# EAGLE design mcu_board_b (EAGLE 7.5.0)
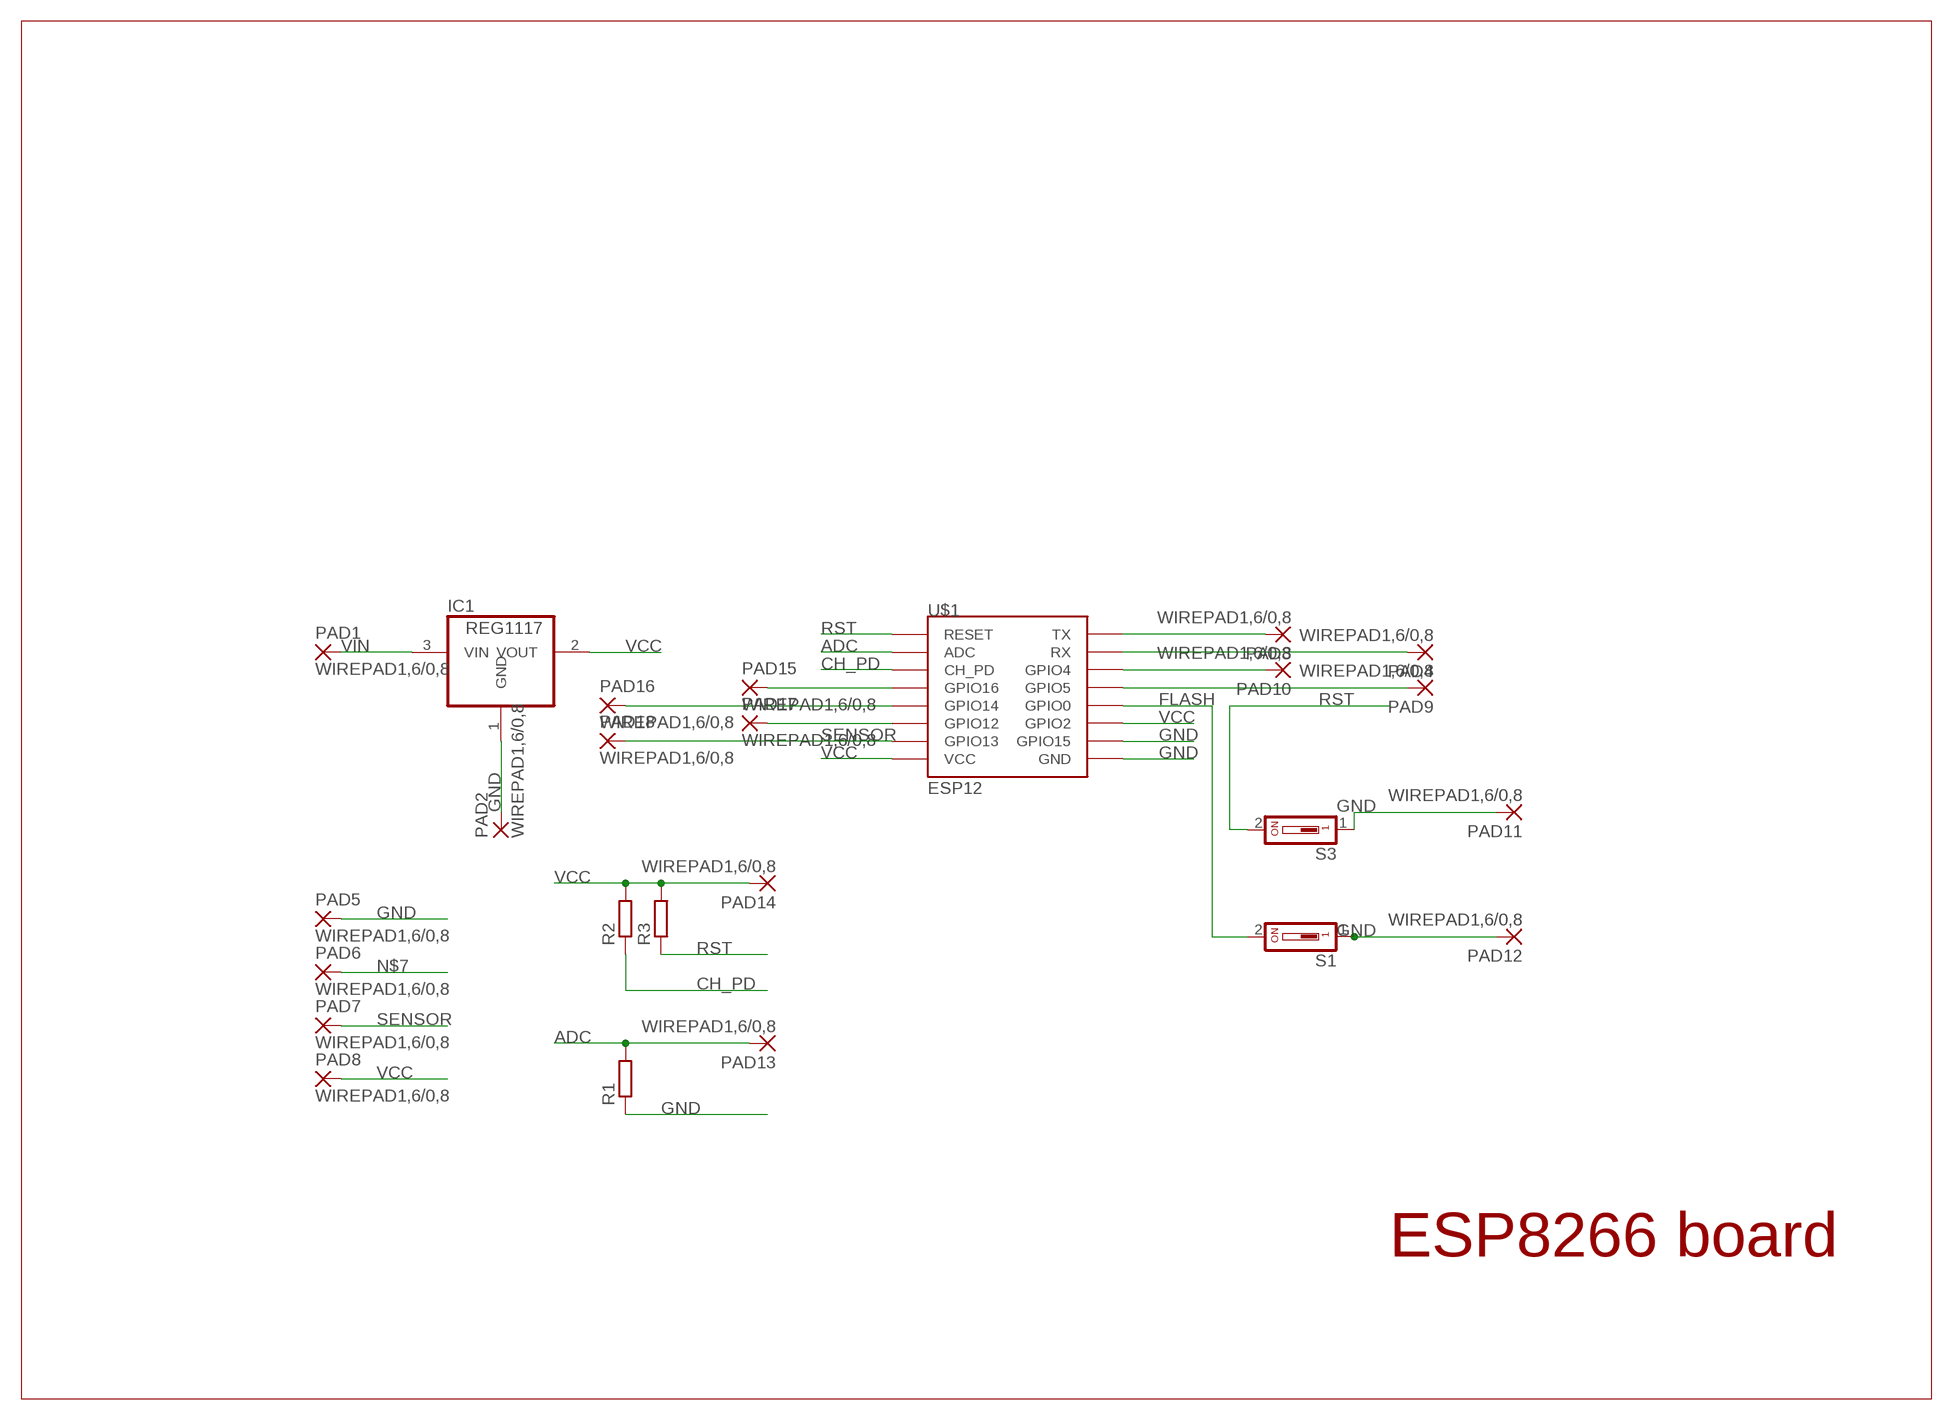
[diagram p0: schematic, sheet 1]

## Parts
IC1  REG1117  [SOT223]
PAD1  WIREPAD1,6/0,8  [1,6/0,8]
PAD2  WIREPAD1,6/0,8  [1,6/0,8]
PAD3  WIREPAD1,6/0,8  [1,6/0,8]
PAD4  WIREPAD1,6/0,8  [1,6/0,8]
PAD5  WIREPAD1,6/0,8  [1,6/0,8]
PAD6  WIREPAD1,6/0,8  [1,6/0,8]
PAD7  WIREPAD1,6/0,8  [1,6/0,8]
PAD8  WIREPAD1,6/0,8  [1,6/0,8]
PAD9  WIREPAD1,6/0,8  [1,6/0,8]
PAD10  WIREPAD1,6/0,8  [1,6/0,8]
PAD11  WIREPAD1,6/0,8  [1,6/0,8]
PAD12  WIREPAD1,6/0,8  [1,6/0,8]
PAD13  WIREPAD1,6/0,8  [1,6/0,8]
PAD14  WIREPAD1,6/0,8  [1,6/0,8]
PAD15  WIREPAD1,6/0,8  [1,6/0,8]
PAD16  WIREPAD1,6/0,8  [1,6/0,8]
PAD17  WIREPAD1,6/0,8  [1,6/0,8]
PAD18  WIREPAD1,6/0,8  [1,6/0,8]
R1  R-EU_M0805  [M0805]
R2  R-EU_M0805  [M0805]
R3  R-EU_M0805  [M0805]
S1  DS01  [DS-01]
S3  DS01  [DS-01]
U$1  ESP12  [ESP12]

## Nets
ADC: PAD13.1(P) R1.2 U$1.ADC
CH_PD: R2.1 U$1.CH_PD
FLASH: S1.2 U$1.GPIO0
GND: IC1.1(GND) PAD2.1(P) PAD5.1(P) PAD11.1(P) PAD12.1(P) R1.1 S1.1 S3.1 U$1.GND U$1.GPIO15
N$1: PAD3.1(P) U$1.TX
N$2: PAD4.1(P) U$1.RX
N$3: PAD10.1(P) U$1.GPIO4
N$4: PAD9.1(P) U$1.GPIO5
N$5: PAD15.1(P) U$1.GPIO16
N$6: PAD16.1(P) U$1.GPIO14
N$7: PAD6.1(P)
N$8: PAD17.1(P) U$1.GPIO12
RST: R3.1 S3.2 U$1.RESET
SENSOR: PAD7.1(P) PAD18.1(P) U$1.GPIO13
VCC: IC1.2(VOUT) PAD8.1(P) PAD14.1(P) R2.2 R3.2 U$1.GPIO2 U$1.VCC
VIN: IC1.3(VIN) PAD1.1(P)

## Notes on the sheet
- ESP8266 board

## Library data of the parts
IC1 = burr-brown:REG1117: 800mA and 1A Low Dropout (LDO) Positive Regulator 1.8V, 2.5V, 2.85V, 3.3V, 5V, and Adj; MPN: REG1117; OC_FARNELL: 1097566; OC_NEWARK: 14P6981
PAD1-PAD18 = wirepad:WIREPAD: Wire PAD connect wire on PCB
R1-R3 = rcl:R-EU_: RESISTOR, European symbol
S1 S3 = switch-dil:DS01: DIL/CODE SWITCH; OC_FARNELL: unknown; OC_NEWARK: unknown
U$1 = esp8266modules:ESP12: ESP8266 Wifi module 12

## Board
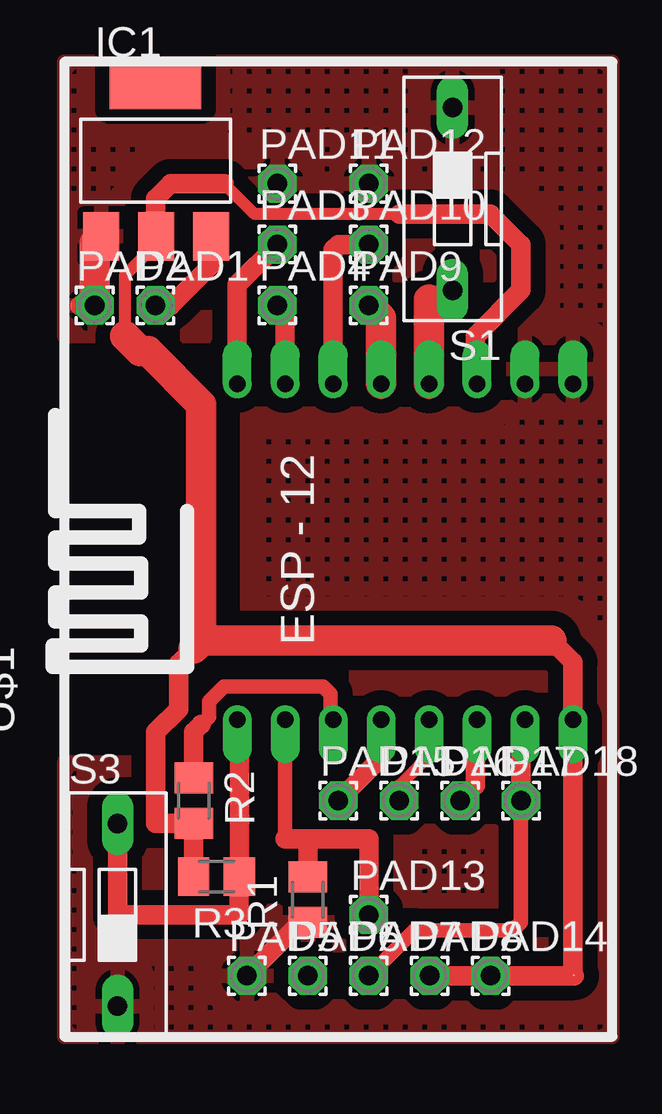
[diagram p1: board, top side]
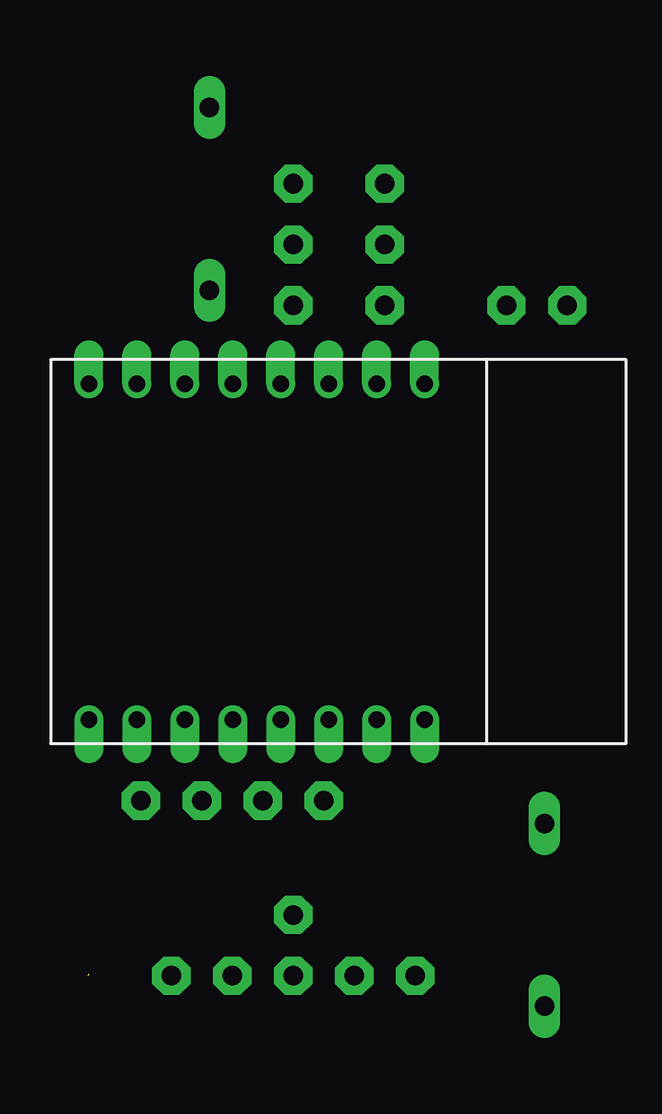
[diagram p2: board, bottom side, seen from below]

No outline drawn. Coordinates in mm, seen from the top.
Copper layers (1*16): Top 0.035mm / dielectric 1.5mm / Bottom 0.035mm
Design rules "default": minimum track width 10mil, minimum drill 24mil, track to track 8mil, track to pad 8mil, pad to pad 8mil, via to via 8mil, smd to smd 8mil, copper to edge 40mil, drill to drill 8mil, minimum pad ring 10mil, minimum via ring 8mil, stop-mask expansion 4mil, vias tented up to drill 0mil, thermal gap 10mil

### Footprints (pad centres in the part's own frame; a part is rotated, then mirrored left to right if it is on the bottom)
SOT223 = smd 1.499 x 2.007: 1 -2.261,-3.15; 2 0.025,-3.15; 3 2.311,-3.15 | smd 3.81 x 2.007: 4 0,3.15
1,6/0,8 = drill 0.813 pad 1.6 octagon: 1 0,0
M0805 = smd 1.3 x 1.6: 1 -0.95,0; 2 0.95,0
DS-01 = drill 0.813 long: 1 0,-3.81; 2 0,3.81
ESP12 = drill 0.7 offset: ADC -7.1,3.8; CH_PD -7.1,1.8; GND 6.9,-8.2; GPIO0 6.9,-2.2; GPIO2 6.9,-4.2; GPIO4 6.9,1.8; GPIO5 6.9,-0.2; GPIO12 -7.1,-4.2; GPIO13 -7.1,-6.2; GPIO14 -7.1,-2.2; GPIO15 6.9,-6.2; GPIO16 -7.1,-0.2; RESET -7.1,5.8; RX 6.9,3.8; TX 6.9,5.8; VCC -7.1,-8.2

### Placement (x,y rotation side)
IC1  3.81,36.51 0 top
PAD1  3.81,30.48 0 top
PAD2  1.27,30.48 0 top
PAD3  8.89,33.02 0 top
PAD4  8.89,30.48 0 top
PAD5  7.62,2.54 0 top
PAD6  10.16,2.54 0 top
PAD7  12.7,2.54 0 top
PAD8  15.24,2.54 0 top
PAD9  12.7,30.48 0 top
PAD10  12.7,33.02 0 top
PAD11  8.89,35.56 0 top
PAD12  12.7,35.56 0 top
PAD13  12.7,5.08 0 top
PAD14  17.78,2.54 0 top
PAD15  11.43,9.84 0 top
PAD16  13.97,9.84 0 top
PAD17  16.51,9.84 0 top
PAD18  19.05,9.84 0 top
R1  10.16,5.71 90 top
R2  5.4,9.84 270 top
R3  6.35,6.67 180 top
S1  16.19,34.92 180 top
S3  2.22,5.08 0 top
U$1  13.02,20.32 90 top

### Tracks (layer width: path | path; a pad name or v marks a point on that pad's centre or on a via)
ADC
  Top 0.61: U$1.ADC 9.22,12.38 | 9.22,12.38 9.22,12.07 | 9.21,8.26 9.21,12.37 9.22,12.38
  Top 0.813: R1.2 10.16,8.26 | 10.16,8.26 9.21,8.26 | PAD13.1 12.7,8.26 10.16,8.26
CH_PD
  Top 0.61: 5.71,13.02 6.03,13.34 6.03,13.97 6.67,14.61 10.79,14.61 11.11,14.29 11.11,13.32 U$1.CH_PD
  Top 0.813: R2.1 5.4,12.7 5.71,13.02
FLASH
  Top 0.813: S1.2 15.85,31.11 15.22,30.48
  Top 1.27: U$1.GPIO0 15.22,30.48 15.22,30.74
GND
  Top 0.813: PAD2.1 0.64,30.48 | R1.1 9.85,4.76 PAD5.1
  Top 1.27: PAD2.1 1.27,33.08 IC1.1
  pour Top (isolate 0.61, hatched): 0,0 0,11.43 7.62,11.43 7.62,29.21 0,29.21 0,40.64 22.86,40.64 22.86,0
N$1
  Top 0.813: U$1.TX 7.22,31.35 PAD3.1
N$2
  Top 0.813: U$1.RX 9.22,30.15 PAD4.1
N$3
  Top 0.813: U$1.GPIO4 11.22,32.81 11.43,33.02 PAD10.1
N$4
  Top 1.27: U$1.GPIO5 13.22,29.96 PAD9.1
N$5
  Top 0.813: U$1.GPIO16 13.22,11.63 PAD15.1
N$6
  Top 0.508: PAD16.1 13.97,10.48 15.24,11.75 15.24,13.2
  Top 0.813: 15.24,13.2 U$1.GPIO14
N$8
  Top 0.813: PAD17.1 17.14,10.48 17.14,13.15 U$1.GPIO12
RST
  Top 0.813: U$1.RESET 7.22,12.3 7.3,12.21 R3.1 7.3,5.08 2.22,5.08 S3.2
SENSOR
  Top 0.61: PAD7.1 14.61,4.45 18.73,4.45 19.05,4.76 PAD18.1
  Top 0.813: PAD18.1 19.05,13.05 U$1.GPIO13
VCC  (1 unrouted)
  Top 0.508: 2.54,29.21 2.54,31.75 3.81,33.02 3.81,33.34 IC1.2 3.81,33.39 | 13.97,34.29 7.94,34.29 6.67,35.56
  Top 0.813: 20.32,16.51 21.22,15.61 U$1.VCC 21.22,2.6 | 13.97,34.29 17.78,34.29 19.05,33.02 19.05,31.11 17.14,29.21 17.14,27.29 U$1.GPIO2 | 6.67,35.56 4.45,35.56 3.81,34.92 3.81,33.39 | 21.27,2.54 PAD14.1 PAD8.1 | 5.4,16.19 4.76,15.56 4.76,13.65 3.81,12.7 3.81,8.89 R2.2 R3.2
  Top 1.27: 20.32,16.51 5.71,16.51 | 5.71,16.51 5.71,26.35 3.49,28.57 3.17,28.57 2.54,29.21 | 5.71,16.51 5.4,16.19
VIN
  Top 0.813: PAD1.1 4.45,30.48 6.12,32.16 IC1.3